# Altium schematic sheet ESP32-WROOM-32.SchDoc
size A4; Author: Jay R Chotaliya; CompanyName: PlumPot; Revision: V1; SheetNumber: 2; SheetTotal: 6
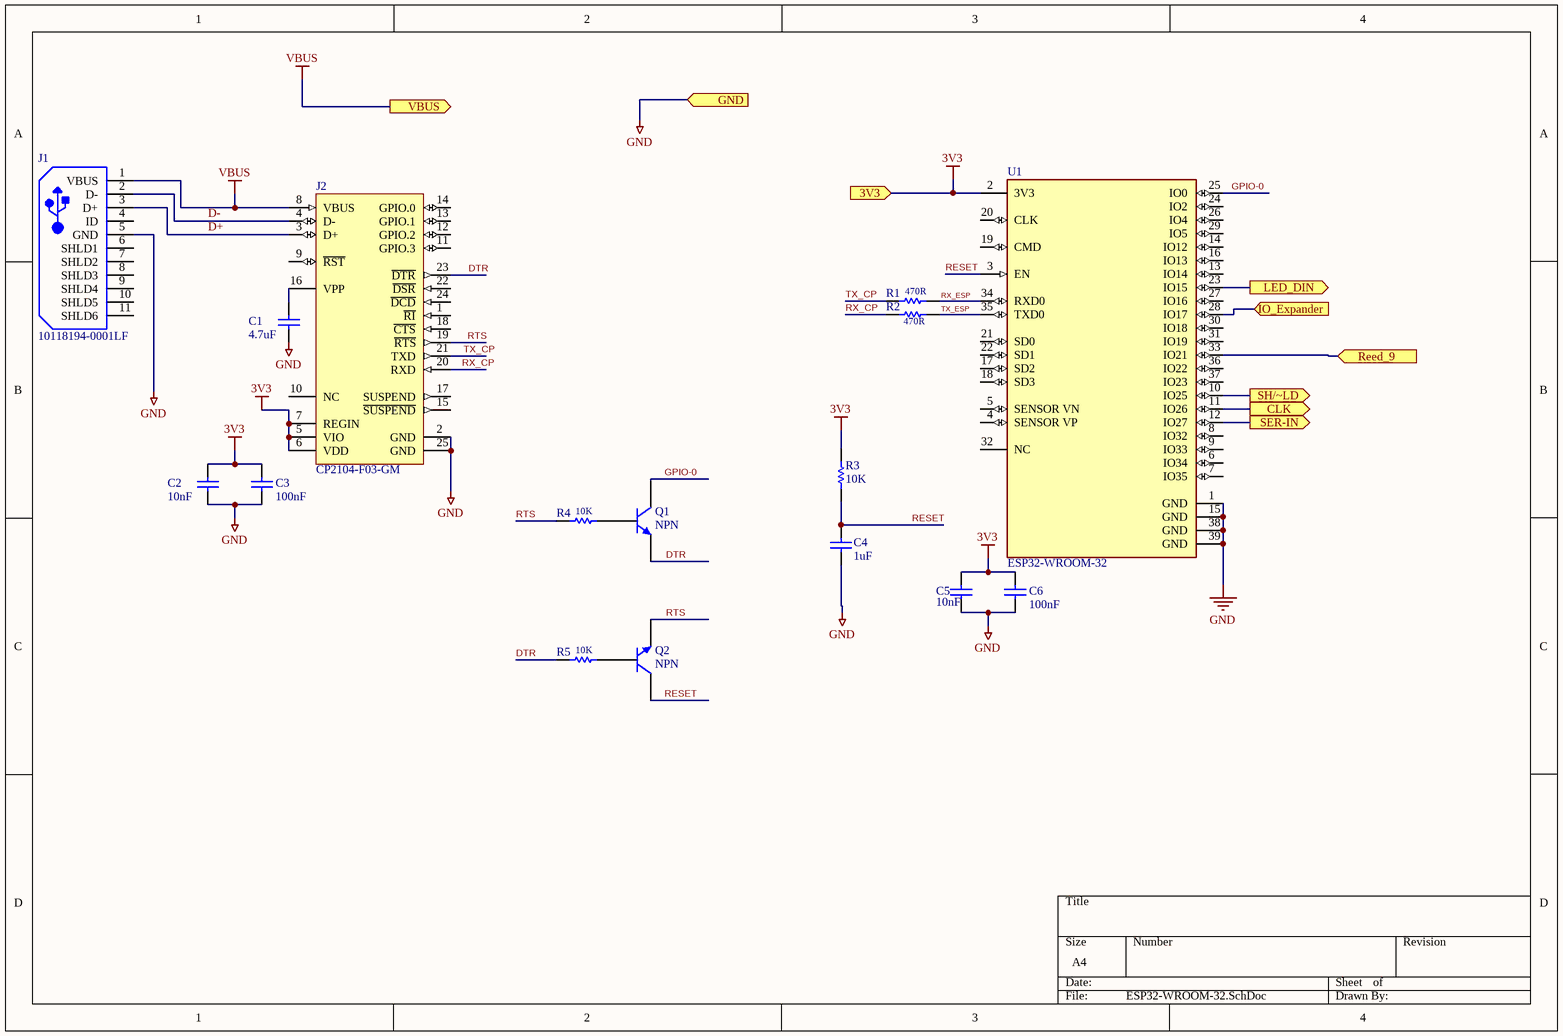
[diagram p0: ESP32-WROOM-32.SchDoc]

## Parts
C1  4.7uF  [CAPC1608X90X20LL10]
C2  10nF  [CAPC1608X90X20LL10]
C3  100nF  [CAPC1608X90X20LL10]
C4  1uF  [CAPC1608X90X20LL10]
C5  10nF  [CAPC1608X90X20LL10]
C6  100nF  [CAPC1608X90X20LL10]
J1  10118194-0001LF  [FCI-10118194-0001LF-5_V]
J2  CP2104-F03-GM  [SLAB-QFN-24-2675x2675TP_M]
Q1  NPN  [SOT23_N]
Q2  NPN  [SOT23_N]
R1  470R  [RESC1608X55X25LL10T15]
R2  470R  [RESC1608X55X25LL10T15]
R3  10K  [RESC1608X55X25LL10T15]
R4  10K  [RESC1608X55X25LL10T15]
R5  10K  [RESC1608X55X25LL10T15]
U1  ESP32-WROOM-32  [FP-ESP32-WROOM-32-MFG]

## Ports
3V3 (in), CLK (out), GND (in), IO_Expander (in), LED_DIN (out), Reed_9 (in), SER-IN (out), SH/~LD (out), VBUS (out)

## Nets
3V3: C2.2 C3.2 C5.2 C6.2 J2.5(VIO) J2.6(VDD) J2.7(REGIN) R3.2 U1.2(3V3) ; port 3V3
GND: C1.1 C2.1 C3.1 C4.1 C5.1 C6.1 J1.5(GND) J2.2(GND) J2.25(GND) U1.1(GND) U1.15(GND) U1.38(GND) U1.39(GND) ; port GND
VBUS: J1.1(VBUS) J2.8(VBUS) ; port VBUS
CLK: U1.11(IO26) ; port CLK
D+: J1.3(D+) J2.3(D+)
D-: J1.2(D-) J2.4(D-)
DTR: J2.23(~{DTR}) Q1.3(E) R5.2
GPIO-0: Q1.1(C) U1.25(IO0)
IO_Expander: U1.28(IO17) ; port IO_Expander
LED_DIN: U1.23(IO15) ; port LED_DIN
Reed_9: U1.33(IO21) ; port Reed_9
RESET: C4.2 Q2.1(C) R3.1 U1.3(EN)
RTS: J2.19(~{RTS}) Q2.3(E) R4.2
RX_CP: J2.20(RXD) R2.2
RX_ESP: R1.1 U1.34(RXD0)
SER-IN: U1.12(IO27) ; port SER-IN
SH/~LD: U1.10(IO25) ; port SH/~LD
TX_CP: J2.21(TXD) R1.2
TX_ESP: R2.1 U1.35(TXD0)
NetC1_2: C1.2 J2.16(VPP)
NetQ1_2: Q1.2(B) R4.1
NetQ2_2: Q2.2(B) R5.1

Not connected (* = marked no-connect by the designer): J1 4(ID) 6(SHLD1) 7(SHLD2) 8(SHLD3) 9(SHLD4) 10(SHLD5) 11(SHLD6); J2 1(~{RI}) 9(~{RST}) 10(NC) 11(GPIO.3) 12(GPIO.2) 13(GPIO.1) 14(GPIO.0) 15(~{SUSPEND}) 17(SUSPEND) 18(~{CTS}) 22(~{DSR}) 24(~{DCD}); U1 4(SENSOR_VP) 5(SENSOR_VN) 6(IO34) 7(IO35) 8(IO32) 9(IO33) 13(IO14) 14(IO12) 16(IO13) 17(SD2) 18(SD3) 19(CMD) 20(CLK) 21(SD0) 22(SD1) 24(IO2) 26(IO4) 27(IO16) 29(IO5) 30(IO18) 31(IO19) 32(NC) 36(IO22) 37(IO23)

## Library data of the parts
C1 C2 C4 C5 = CMP-2000-07546-1: Chip Capacitor, 0.1 uF, +/- 10%, 50 V, -55 to 125 degC, 0603 (1608 Metric), RoHS, Tape and Reel; Manufacturer: TDK; Capacitance: 100nF; Voltage: 50V; Dielectric: X7R; Package Reference: 603; Radiation Hardening: No; Composition: Ceramic; Datasheet URL: https://product.tdk.com/info/en/catalog/datasheets/mlcc_automotive_general_en.pdf; Mounting Technology: SurfaceMount; Datasheet Version: 12/2014; Width: 0.8mm; Length: 1.6mm; Tolerance: 10%; Case Code (Imperial): 0603; RoHSCompliant: True; Min Operating Temperature: -55degC; Package Description: 2-Pin Surface Mount Device, Body 1.6 x 0.8 mm; Packaging: TapeandReel; Package Quantity: 1; Voltage Rating: 50V; Mount: SurfaceMount; Lead Free: LeadFree; Depth: 0.8mm; Termination: SMD/SMT; Case Code (Metric): 1608; Thickness: 0.035inch; Height: 0.8mm; Weight: 7.1E-05oz; Voltage Rating (DC): 50V; REACH SVHC: NoSVHC; Manufacturer URL: http://www.tdk.com/; Case/Package: 0603; Max Operating Temperature: 125degC
C3 C6 = CMP-2000-07546-1: Chip Capacitor, 0.1 uF, +/- 10%, 50 V, -55 to 125 degC, 0603 (1608 Metric), RoHS, Tape and Reel; Manufacturer: TDK; Voltage: 50V; Dielectric: X7R; Package Reference: 603; Radiation Hardening: No; Composition: Ceramic; Datasheet URL: https://product.tdk.com/info/en/catalog/datasheets/mlcc_automotive_general_en.pdf; Mounting Technology: SurfaceMount; Datasheet Version: 12/2014; Width: 0.8mm; Length: 1.6mm; Capacitance: 100nF; Tolerance: 10%; Case Code (Imperial): 0603; RoHSCompliant: True; Min Operating Temperature: -55degC; Package Description: 2-Pin Surface Mount Device, Body 1.6 x 0.8 mm; Packaging: TapeandReel; Package Quantity: 1; Voltage Rating: 50V; Mount: SurfaceMount; Lead Free: LeadFree; Depth: 0.8mm; Termination: SMD/SMT; Case Code (Metric): 1608; Thickness: 0.035inch; Height: 0.8mm; Weight: 7.1E-05oz; Voltage Rating (DC): 50V; REACH SVHC: NoSVHC; Manufacturer URL: http://www.tdk.com/; Case/Package: 0603; Max Operating Temperature: 125degC
J1 = CMP-2000-05120-1: Micro USB B Type Receptacle, 1.8 A, -55 to 85 degC, 5-Pin SMD, RoHS, Tape and Reel; Manufacturer: Amphenol FCI; Body Orientation: RightAngle; Number of Contacts: 5; Pitch: 0.65mm; Gender: RCP; Rad Hard: No; Package Reference: 10118194-0001LF-5; Mounting: SurfaceMount; Manufacturer URL: http://www.fci.com/; Packaging: CutTape; Datasheet URL: https://datasheet.ciiva.com/26945/getdatasheetpartid-418619-26945695.pdf; Termination Method: Solder; Package Description: 5-Pin Surface Mount Device, Body 8.05 x 5.53 mm, Pitch 0.65 mm; Type: MicroUSBTypeB; Datasheet Version: Rev. A, 10/2011
J2 = CMP-0511-00004-1: Single-Chip USB to UART Bridge, 4 Dig I/O Pins, Internal Oscillator, 1024 Bytes EEPROM, -40 to 85 degC, 24-pin QFN; Manufacturer: Silicon Labs; Sub-Family: USB Bridges; Internal Oscillator: TRUE; Mounting Technology: Surface Mount; ComponentLink3URL: http://www.silabs.com/Support%20Documents/TechnicalDocs/C8051F93x-92x.pdf; DatasheetVersion: Rev. 1.0; ComponentLink1URL: http://www.silabs.com/; Code_IPC: J-STD-020; ComponentLink2URL: http://www.silabs.com/Support%20Documents/TechnicalDocs/cp2104.pdf; Code_JEDEC: MO-220; PackageReference: QFN-24; ComponentLink3Description: Package Specification; PartNumber: CP2104-F03-GM; ComponentLink1Description: Manufacturer URL; ComponentLink2Description: Datasheet; EEPROM: 1024 Bytes; PackageDescription: 24-Pin Quad-Flat No-Leads Package, Body 4 x 4 mm, Pitch 0.5 mm
Q1 Q2 = NPN: NPN Bipolar Transistor; Published: 8-Jun-2000; LatestRevisionDate: 17-Jul-2002; LatestRevisionNote: Re-released for DXP Platform.; PackageReference: TO-226-AA; Publisher: Altium Limited; PackageDescription: TO, Flat Index; 3 In-Line, Axial Leads; Body Dia. 4.8mm; Leads 0.55 x 0.51 mm (max); Code_JEDEC: TO-226-AA
R1-R5 = CMP-1659-00035-1: General Purpose Chip Resistor, 470 Ohm, +/- 1%, -55 to 155 degC, 0603 (1608 Metric), RoHS, Tape and Reel; Impedance: 50 Ohm; Fastening Type: Snap; Min Operating Temperature: -40 degC; Length: 3 mm; PackageReference: 0603; Contact Material: Brass; Max Operating Temperature: 90 degC; ComponentLink2URL: https://datasheet.ciiva.com/11808/0900766b80f96399-11808177.pdf; Packaging: Tape and Reel; DatasheetVersion: Rev. 4, 04/2009; Contact Plating: Gold; Radiation Hardening: No; Height: 1.25 mm; Resistance: 50 Ohm; RoHSCompliant: true; ComponentLink2Description: Datasheet; Package Quantity: 2500; ComponentLink1URL: http://www.yageo.com/; Width: 3.1 mm; Mount: Surface Mount; PackageDescription: 2-Pin Surface Mount Device, Body 1.6 x 0.8 mm; ComponentLink1Description: Manufacturer URL
U1 = CMP-194065-000008-1: RX TXRX MOD WIFI SURFACE MOUNT; Frequency: 2.5GHz; Sensitivity: -98dBm; Operating Supply Voltage: 3.6V; Data Rate: 150Mbps; Weight: 0.088185oz; Package Quantity: 550; Min Operating Temperature: -40°C; Mount: Surface Mount; Max Operating Temperature: 85°C; Packaging: Cut Tape; Case/Package: SMD/SMT